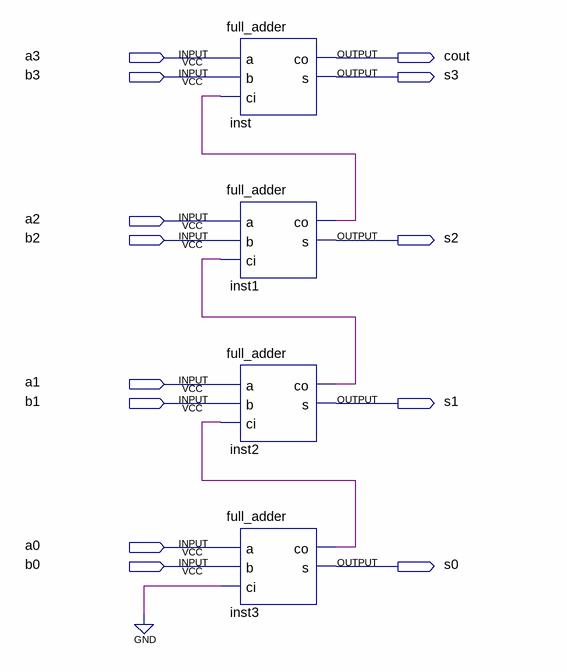
[diagram p0: schematic sheet]
// Quartus schematic ripple_carry.bdf as structural Verilog: 4 symbols, 13 pins
module ripple_carry (
  input  a3,
  input  b3,
  input  a2,
  input  b2,
  input  a1,
  input  b1,
  input  a0,
  input  b0,
  output cout,
  output s3,
  output s2,
  output s1,
  output s0
);

  wire inst1_co, inst2_co, inst3_co;

  full_adder inst (.a(a3), .b(b3), .ci(inst1_co), .co(cout), .s(s3));
  full_adder inst1 (.a(a2), .b(b2), .ci(inst2_co), .co(inst1_co), .s(s2));
  full_adder inst2 (.a(a1), .b(b1), .ci(inst3_co), .co(inst2_co), .s(s1));
  full_adder inst3 (.a(a0), .b(b0), .ci(1'b0), .co(inst3_co), .s(s0));
endmodule
